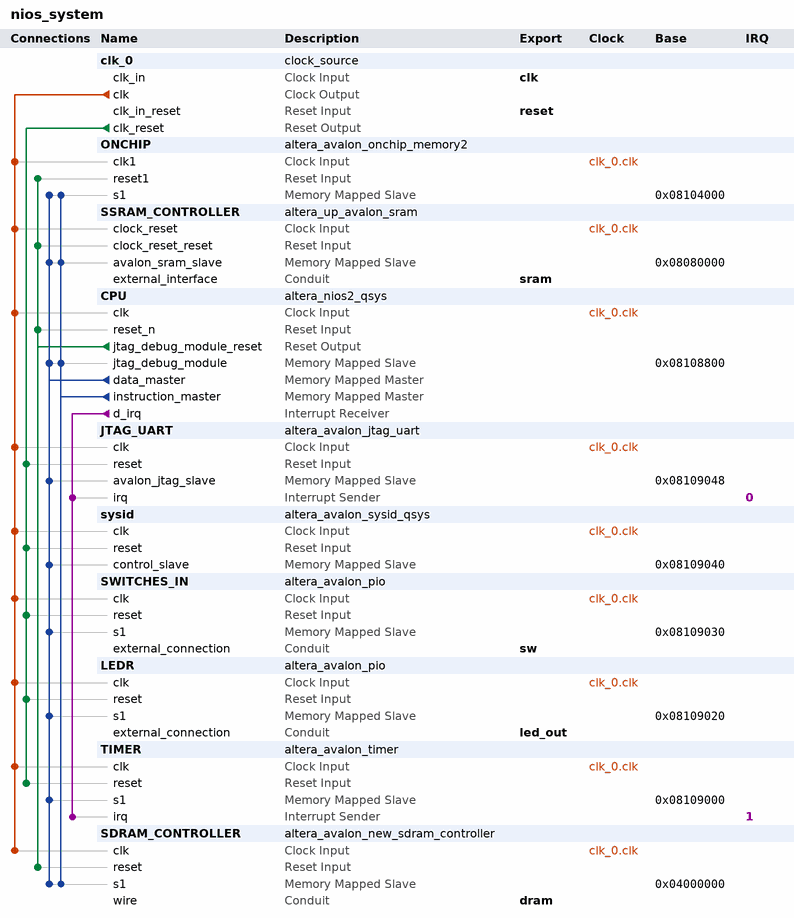
[diagram p0: system contents]
# Platform Designer (Qsys) system nios_system, Cyclone II EP2C20F484C7
# Parameters at their usual value, and those the tool derives, are not listed.
package require -exact qsys 13.0.1.99.2
create_system nios_system
set_project_property DEVICE_FAMILY {Cyclone II}
set_project_property DEVICE EP2C20F484C7

add_instance clk_0 clock_source 13.0
set_instance_parameter_value clk_0 clockFrequency 50000000

add_instance ONCHIP altera_avalon_onchip_memory2 13.0.1.99.2
set_instance_parameter_value ONCHIP dataWidth 32
set_instance_parameter_value ONCHIP dualPort false
set_instance_parameter_value ONCHIP initMemContent true
set_instance_parameter_value ONCHIP initializationFileName onchip_mem.hex
set_instance_parameter_value ONCHIP memorySize 16384

add_instance SSRAM_CONTROLLER altera_up_avalon_sram 13.0
set_instance_parameter_value SSRAM_CONTROLLER board DE1
set_instance_parameter_value SSRAM_CONTROLLER pixel_buffer false

add_instance CPU altera_nios2_qsys 13.0
set_instance_parameter_value CPU resetSlave ONCHIP.s1
set_instance_parameter_value CPU mmu_TLBMissExcSlave None
set_instance_parameter_value CPU exceptionSlave ONCHIP.s1
set_instance_parameter_value CPU breakSlave CPU.jtag_debug_module
set_instance_parameter_value CPU impl Tiny
set_instance_parameter_value CPU icache_size 2048

add_instance JTAG_UART altera_avalon_jtag_uart 13.0.1.99.2
set_instance_parameter_value JTAG_UART simInteractiveOptions NO_INTERACTIVE_WINDOWS

add_instance sysid altera_avalon_sysid_qsys 13.0
set_instance_parameter_value sysid id 0

add_instance SWITCHES_IN altera_avalon_pio 13.0.1.99.2
set_instance_parameter_value SWITCHES_IN direction Input
set_instance_parameter_value SWITCHES_IN width 10

add_instance LEDR altera_avalon_pio 13.0.1.99.2
set_instance_parameter_value LEDR direction Output
set_instance_parameter_value LEDR width 10

add_instance TIMER altera_avalon_timer 13.0.1.99.2
set_instance_parameter_value TIMER period 10
set_instance_parameter_value TIMER periodUnits SEC

add_instance SDRAM_CONTROLLER altera_avalon_new_sdram_controller 13.0.1.99.2
set_instance_parameter_value SDRAM_CONTROLLER TAC 5.5
set_instance_parameter_value SDRAM_CONTROLLER TRCD 20.0
set_instance_parameter_value SDRAM_CONTROLLER TRP 20.0
set_instance_parameter_value SDRAM_CONTROLLER casLatency 3
set_instance_parameter_value SDRAM_CONTROLLER columnWidth 8
set_instance_parameter_value SDRAM_CONTROLLER dataWidth 16
set_instance_parameter_value SDRAM_CONTROLLER generateSimulationModel false
set_instance_parameter_value SDRAM_CONTROLLER model single_Micron_MT48LC4M32B2_7_chip
set_instance_parameter_value SDRAM_CONTROLLER numberOfBanks 4
set_instance_parameter_value SDRAM_CONTROLLER numberOfChipSelects 1
set_instance_parameter_value SDRAM_CONTROLLER powerUpDelay 100.0
set_instance_parameter_value SDRAM_CONTROLLER refreshPeriod 15.625
set_instance_parameter_value SDRAM_CONTROLLER rowWidth 12

# connections
add_connection clk_0.clk CPU.clk clock
add_connection clk_0.clk JTAG_UART.clk clock
add_connection clk_0.clk LEDR.clk clock
add_connection clk_0.clk ONCHIP.clk1 clock
add_connection clk_0.clk SDRAM_CONTROLLER.clk clock
add_connection clk_0.clk SSRAM_CONTROLLER.clock_reset clock
add_connection clk_0.clk SWITCHES_IN.clk clock
add_connection clk_0.clk sysid.clk clock
add_connection clk_0.clk TIMER.clk clock
add_connection clk_0.clk_reset JTAG_UART.reset reset
add_connection clk_0.clk_reset LEDR.reset reset
add_connection clk_0.clk_reset SWITCHES_IN.reset reset
add_connection clk_0.clk_reset sysid.reset reset
add_connection clk_0.clk_reset TIMER.reset reset
add_connection CPU.jtag_debug_module_reset CPU.reset_n reset
add_connection CPU.jtag_debug_module_reset ONCHIP.reset1 reset
add_connection CPU.jtag_debug_module_reset SDRAM_CONTROLLER.reset reset
add_connection CPU.jtag_debug_module_reset SSRAM_CONTROLLER.clock_reset_reset reset
add_connection CPU.data_master CPU.jtag_debug_module avalon
set_connection_parameter_value CPU.data_master/CPU.jtag_debug_module baseAddress 0x08108800
add_connection CPU.data_master JTAG_UART.avalon_jtag_slave avalon
set_connection_parameter_value CPU.data_master/JTAG_UART.avalon_jtag_slave baseAddress 0x08109048
add_connection CPU.data_master LEDR.s1 avalon
set_connection_parameter_value CPU.data_master/LEDR.s1 baseAddress 0x08109020
add_connection CPU.data_master ONCHIP.s1 avalon
set_connection_parameter_value CPU.data_master/ONCHIP.s1 baseAddress 0x08104000
add_connection CPU.data_master SDRAM_CONTROLLER.s1 avalon
set_connection_parameter_value CPU.data_master/SDRAM_CONTROLLER.s1 baseAddress 0x04000000
add_connection CPU.data_master SSRAM_CONTROLLER.avalon_sram_slave avalon
set_connection_parameter_value CPU.data_master/SSRAM_CONTROLLER.avalon_sram_slave baseAddress 0x08080000
add_connection CPU.data_master SWITCHES_IN.s1 avalon
set_connection_parameter_value CPU.data_master/SWITCHES_IN.s1 baseAddress 0x08109030
add_connection CPU.data_master sysid.control_slave avalon
set_connection_parameter_value CPU.data_master/sysid.control_slave baseAddress 0x08109040
add_connection CPU.data_master TIMER.s1 avalon
set_connection_parameter_value CPU.data_master/TIMER.s1 baseAddress 0x08109000
add_connection CPU.instruction_master CPU.jtag_debug_module avalon
set_connection_parameter_value CPU.instruction_master/CPU.jtag_debug_module baseAddress 0x08108800
add_connection CPU.instruction_master ONCHIP.s1 avalon
set_connection_parameter_value CPU.instruction_master/ONCHIP.s1 baseAddress 0x08104000
add_connection CPU.instruction_master SDRAM_CONTROLLER.s1 avalon
set_connection_parameter_value CPU.instruction_master/SDRAM_CONTROLLER.s1 baseAddress 0x04000000
add_connection CPU.instruction_master SSRAM_CONTROLLER.avalon_sram_slave avalon
set_connection_parameter_value CPU.instruction_master/SSRAM_CONTROLLER.avalon_sram_slave baseAddress 0x08080000
add_connection CPU.d_irq JTAG_UART.irq interrupt
set_connection_parameter_value CPU.d_irq/JTAG_UART.irq irqNumber 0
add_connection CPU.d_irq TIMER.irq interrupt
set_connection_parameter_value CPU.d_irq/TIMER.irq irqNumber 1

# exported interfaces
add_interface sram conduit end
set_interface_property sram EXPORT_OF SSRAM_CONTROLLER.external_interface
add_interface dram conduit end
set_interface_property dram EXPORT_OF SDRAM_CONTROLLER.wire
add_interface sw conduit end
set_interface_property sw EXPORT_OF SWITCHES_IN.external_connection
add_interface led_out conduit end
set_interface_property led_out EXPORT_OF LEDR.external_connection
add_interface reset reset sink
set_interface_property reset EXPORT_OF clk_0.clk_in_reset
add_interface clk clock sink
set_interface_property clk EXPORT_OF clk_0.clk_in

set_interconnect_requirement {$system} qsys_mm.clockCrossingAdapter HANDSHAKE
set_interconnect_requirement {$system} qsys_mm.maxAdditionalLatency 1

save_system nios_system.qsys
